# EAGLE design 380 NFB (EAGLE 6.2)
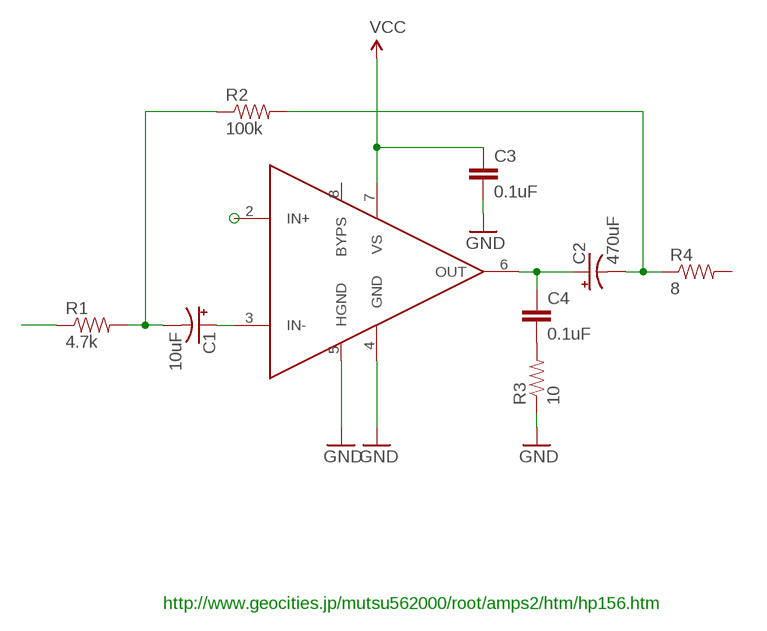
[diagram p0: schematic, sheet 1]

## Parts
C1  10uF  CAP_POLPTH1  [CPOL-RADIAL-100UF-25V]
C2  470uF  CAP_POLPTH4  [CPOL-RADIAL-1000UF-25V]
C3  0.1uF  CAPKIT  [CAP-PTH-SMALL-KIT]
C4  0.1uF  CAPKIT  [CAP-PTH-SMALL-KIT]
R1  4.7k  RESISTORAXIAL-0.3  [AXIAL-0.3]
R2  100k  RESISTORAXIAL-0.3  [AXIAL-0.3]
R3  10  RESISTORAXIAL-0.3  [AXIAL-0.3]
R4  8  RESISTORAXIAL-0.3  [AXIAL-0.3]
U$1  LM380N-8  [DIL08]

## Nets
GND: C3.2 R3.P$1 U$1.4(GND) U$1.5(HGND)
N$1: C1.1(+) U$1.3(IN-)
N$2: C1.2(-) R1.P$2 R2.P$1
N$3: C2.2(-) R2.P$2 R4.P$1
N$4: C2.1(+) C4.1 U$1.6(OUT)
N$5: C4.2 R3.P$2
N$7: R1.P$1
VCC: C3.1 U$1.7(VS)
Unconnected: R4.P$2 U$1.2(IN+) U$1.8(BYPS)

## Notes on the sheet
- http://www.geocities.jp/mutsu562000/root/amps2/htm/hp156.htm

## Library data of the parts
C1 C2 = SparkFun:CAP_POL: Capacitor Polarized These are standard SMD and PTH capacitors. Normally 10uF, 47uF, and 100uF in electrolytic and tantalum varieties. Always verify the external diameter of the through hole cap, it varies with capacity, voltage, and manufacturer. The EIA devices should be standard.
C3 C4 = SparkFun:CAP: Capacitor Standard 0603 ceramic capacitor, and 0.1" leaded capacitor.
R1-R4 = My Library:RESISTOR: Resistor Basic schematic elements and footprints for 0603, 1206, and PTH resistors.
U$1 = My Library:LM380

## Board
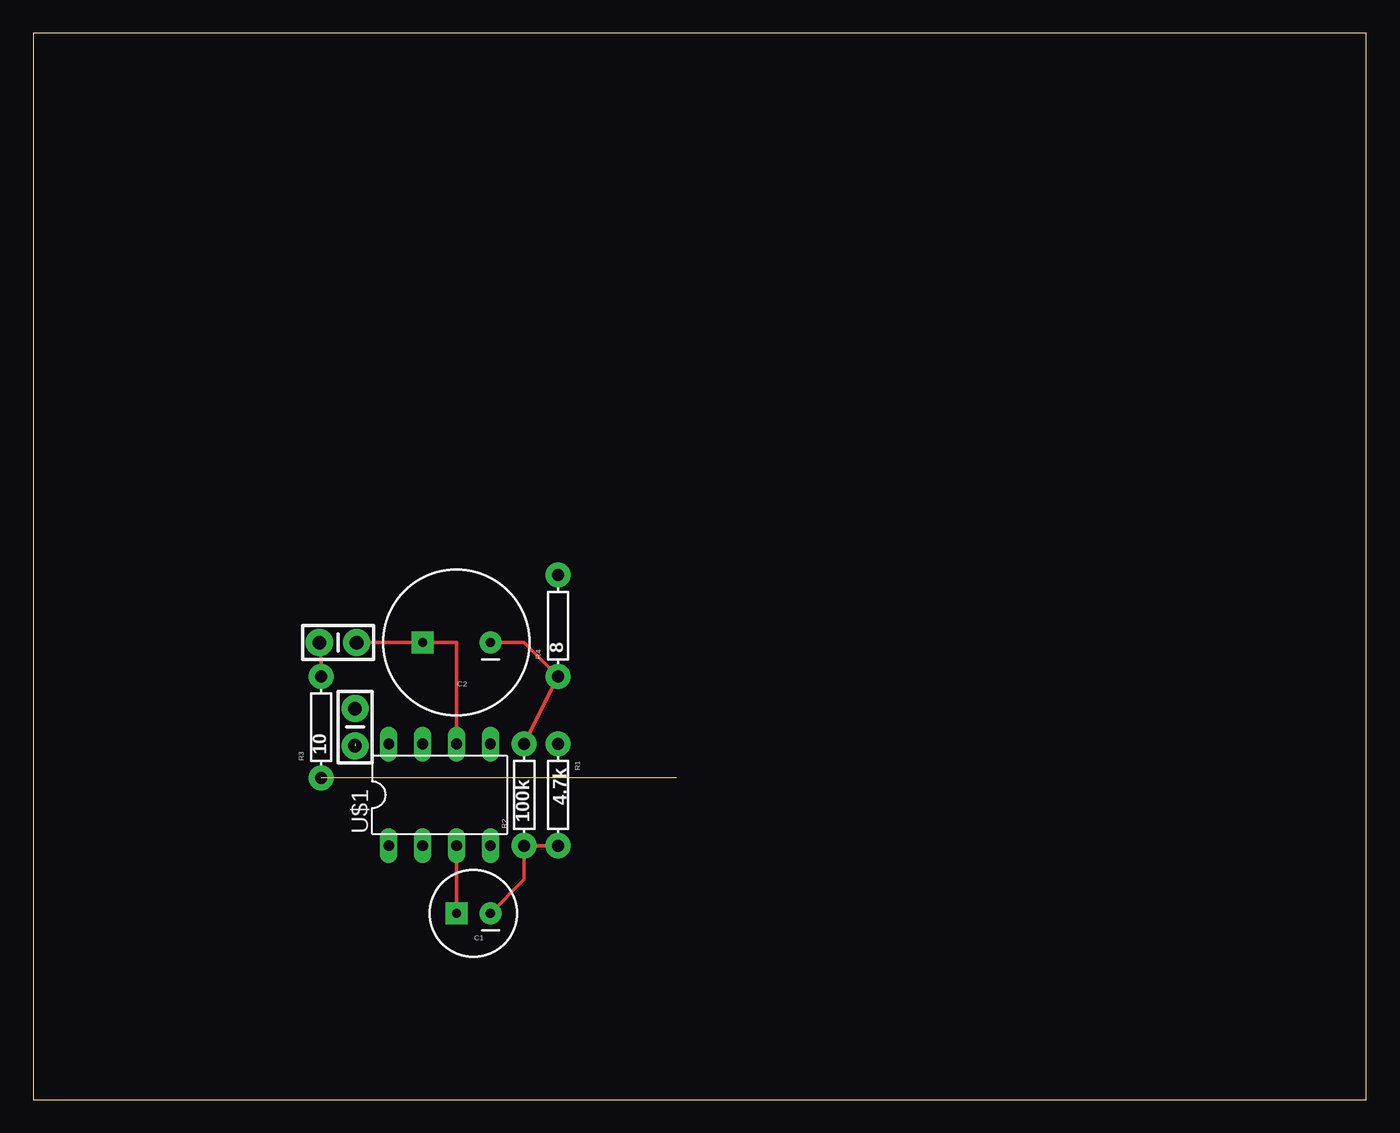
[diagram p1: board, top side]
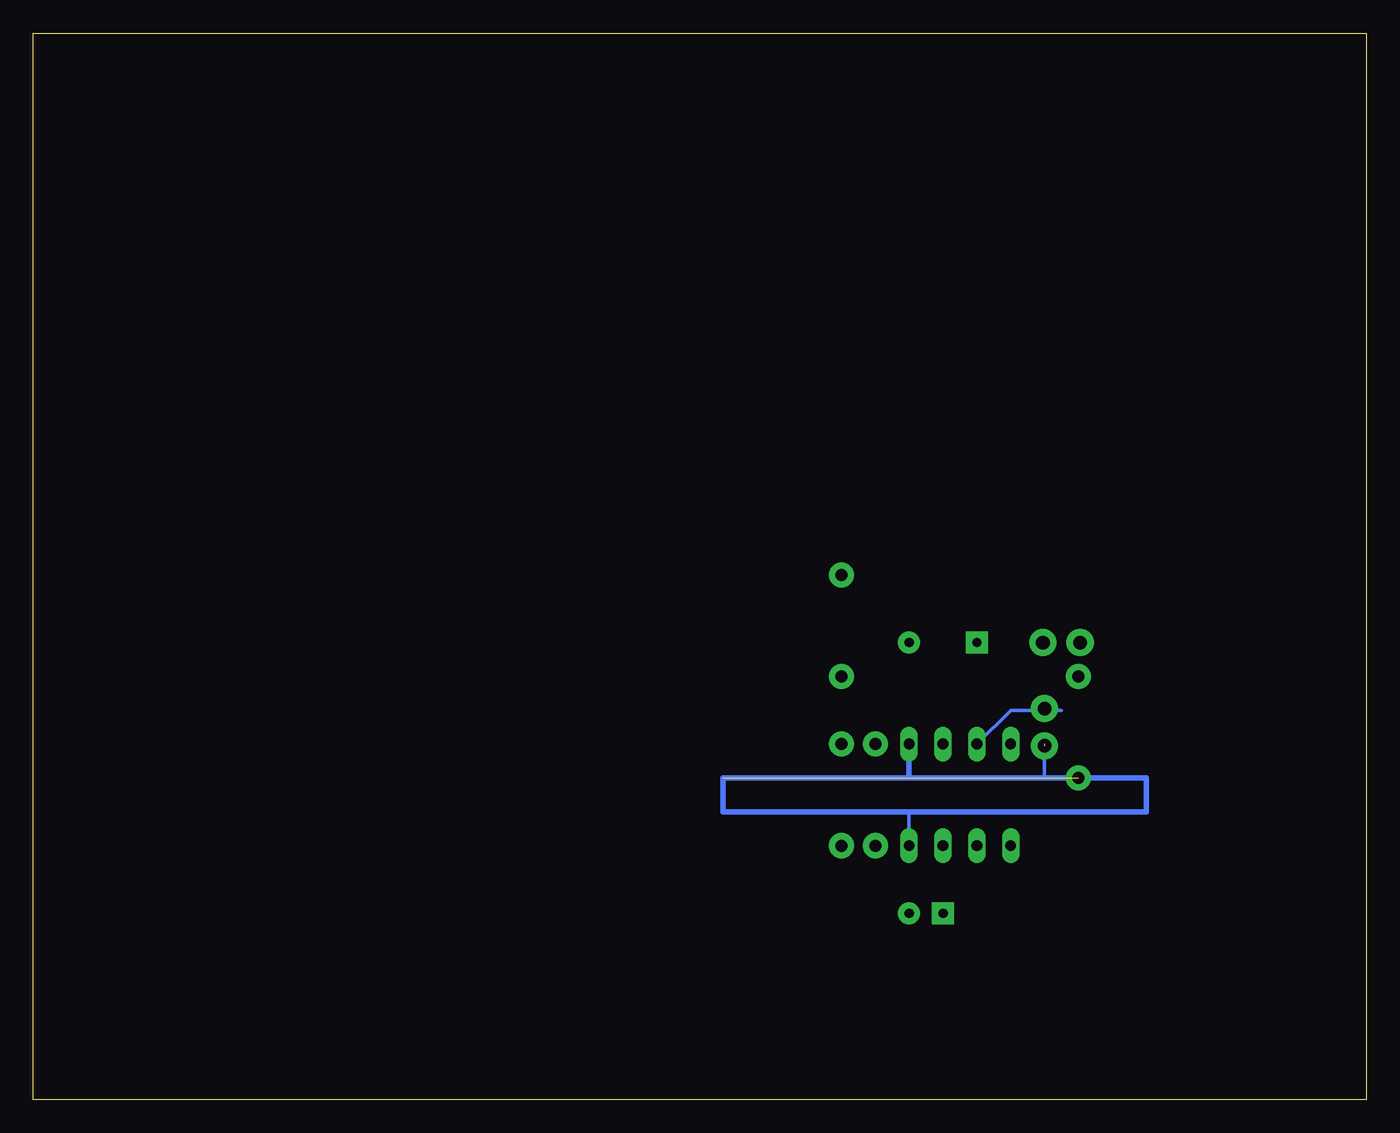
[diagram p2: board, bottom side, seen from below]

Size 100 x 80 mm. Coordinates in mm from the lower left corner, seen from the top.
Outline: 0,0 100,0 100,80 0,80 0,0
Copper layers (1*16): Top 0.035mm / dielectric 1.5mm / Bottom 0.035mm
Design rules: minimum track width 10mil, minimum drill 24mil, track to track 8mil, track to pad 8mil, pad to pad 8mil, via to via 8mil, smd to smd 8mil, copper to edge 40mil, drill to drill 8mil, minimum pad ring 10mil, minimum via ring 8mil, stop-mask expansion 4mil, vias tented up to drill 0mil, thermal gap 10mil

### Footprints (pad centres in the part's own frame; a part is rotated, then mirrored left to right if it is on the bottom)
CPOL-RADIAL-100UF-25V = drill 0.7 pad 1.651 square: 1 1.27,0 | drill 0.7 pad 1.651: 2 -1.27,0
CPOL-RADIAL-1000UF-25V = drill 0.7 pad 1.651 square: 1 2.54,0 | drill 0.7 pad 1.651: 2 -2.54,0
CAP-PTH-SMALL-KIT = drill 1.016 pad 2.032: 1 -1.397,0; 2 1.397,0
AXIAL-0.3 = drill 0.9 pad 1.88: P$1 -3.81,0; P$2 3.81,0
DIL08 = drill 0.813 long: 1 -3.81,-3.81; 2 -1.27,-3.81; 3 1.27,-3.81; 4 3.81,-3.81; 5 3.81,3.81; 6 1.27,3.81; 7 -1.27,3.81; 8 -3.81,3.81

### Placement (x,y rotation side)
C1  33.02,13.97 180 top
C2  31.75,34.29 180 top
C3  24.13,27.94 270 top
C4  22.86,34.29 180 top
R1  39.37,22.86 270 top
R2  36.83,22.86 90 top
R3  21.59,27.94 90 top
R4  39.37,35.56 90 top
U$1  30.48,22.86 0 top

### Tracks (layer width: path | path; a pad name or v marks a point on that pad's centre or on a via)
GND  (2 unrouted)
  Bottom 0.254: 34.29,21.59 U$1.4 | 24.13,24.13 C3.2 24.13,26.67
  Bottom 0.406: 34.29,24.13 U$1.5 34.29,24.13 | 34.29,24.13 24.13,24.13 16.51,24.13 16.51,21.59 34.29,21.59 48.26,21.59 48.26,24.13 34.29,24.13
N$1
  Top 0.254: C1.1 U$1.3
N$2
  Top 0.254: C1.2 36.83,16.51 R2.P$1 R1.P$2
N$3
  Top 0.254: R2.P$2 R4.P$1 36.83,34.29 C2.2
N$4
  Top 0.254: 31.75,34.29 U$1.6 | 31.75,34.29 C4.1 31.75,34.29 | 31.75,34.29 C2.1
N$5
  Top 0.254: R3.P$2 21.59,33.02 C4.2
VCC
  Bottom 0.254: U$1.7 26.67,29.21 22.86,29.21 C3.1